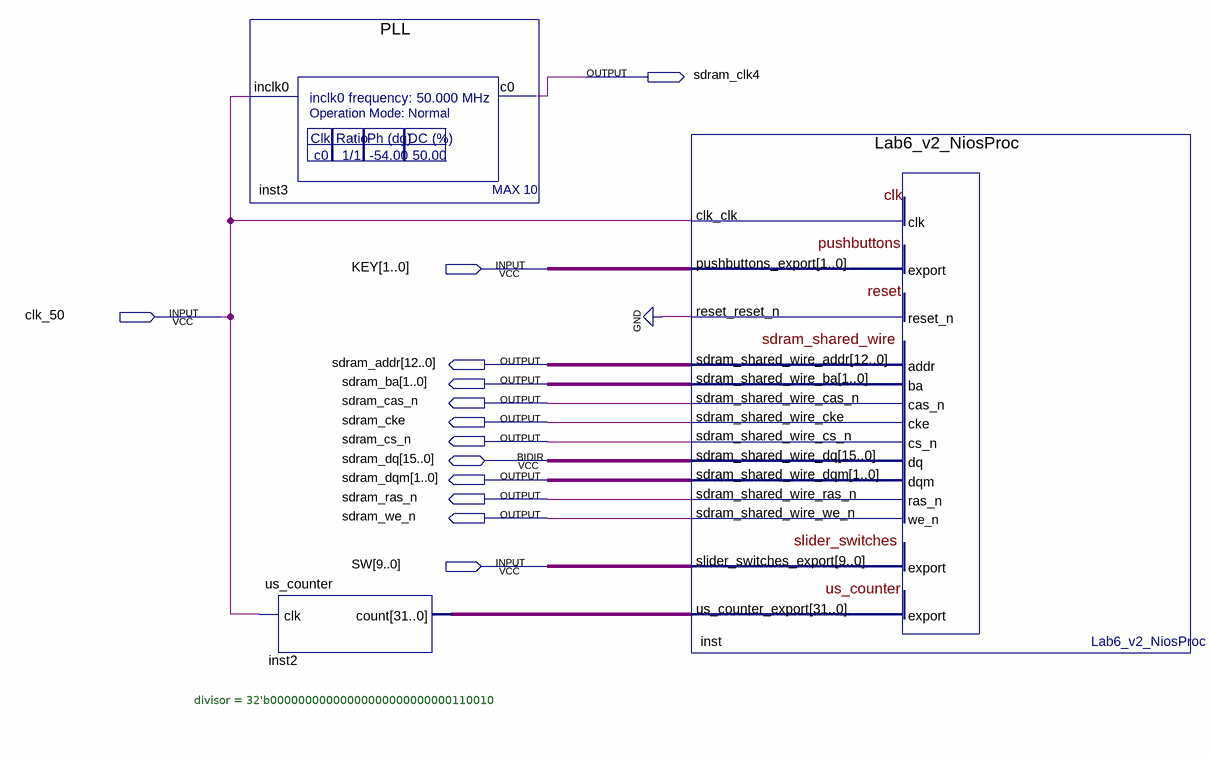
[diagram p0: schematic sheet]
// Quartus schematic us_counter_module.bdf as structural Verilog: 3 symbols, 13 pins
module us_counter_module (
  input  [1:0] KEY,
  input  clk_50,
  input  [9:0] SW,
  inout  [15:0] sdram_dq,
  output sdram_clk4,
  output [12:0] sdram_addr,
  output [1:0] sdram_ba,
  output sdram_cas_n,
  output sdram_cke,
  output sdram_cs_n,
  output [1:0] sdram_dqm,
  output sdram_ras_n,
  output sdram_we_n
);

  wire [31:0] inst2_count;

  PLL inst3 (.inclk0(clk_50), .c0(sdram_clk4));
  us_counter #(.divisor(32'b00000000000000000000000000110010)) inst2 (.clk(clk_50), .count(inst2_count));
  Lab6_v2_NiosProc inst (
    .clk_clk(clk_50), .pushbuttons_export(KEY), .reset_reset_n(1'b0), .slider_switches_export(SW),
    .us_counter_export(inst2_count), .sdram_shared_wire_addr(sdram_addr), .sdram_shared_wire_ba(sdram_ba),
    .sdram_shared_wire_cas_n(sdram_cas_n), .sdram_shared_wire_cke(sdram_cke),
    .sdram_shared_wire_cs_n(sdram_cs_n), .sdram_shared_wire_dqm(sdram_dqm),
    .sdram_shared_wire_ras_n(sdram_ras_n), .sdram_shared_wire_we_n(sdram_we_n),
    .sdram_shared_wire_dq(sdram_dq));
endmodule
